# EasyEDA Pro project kod-01-akdk.eprj, board kod-01-left-pcb
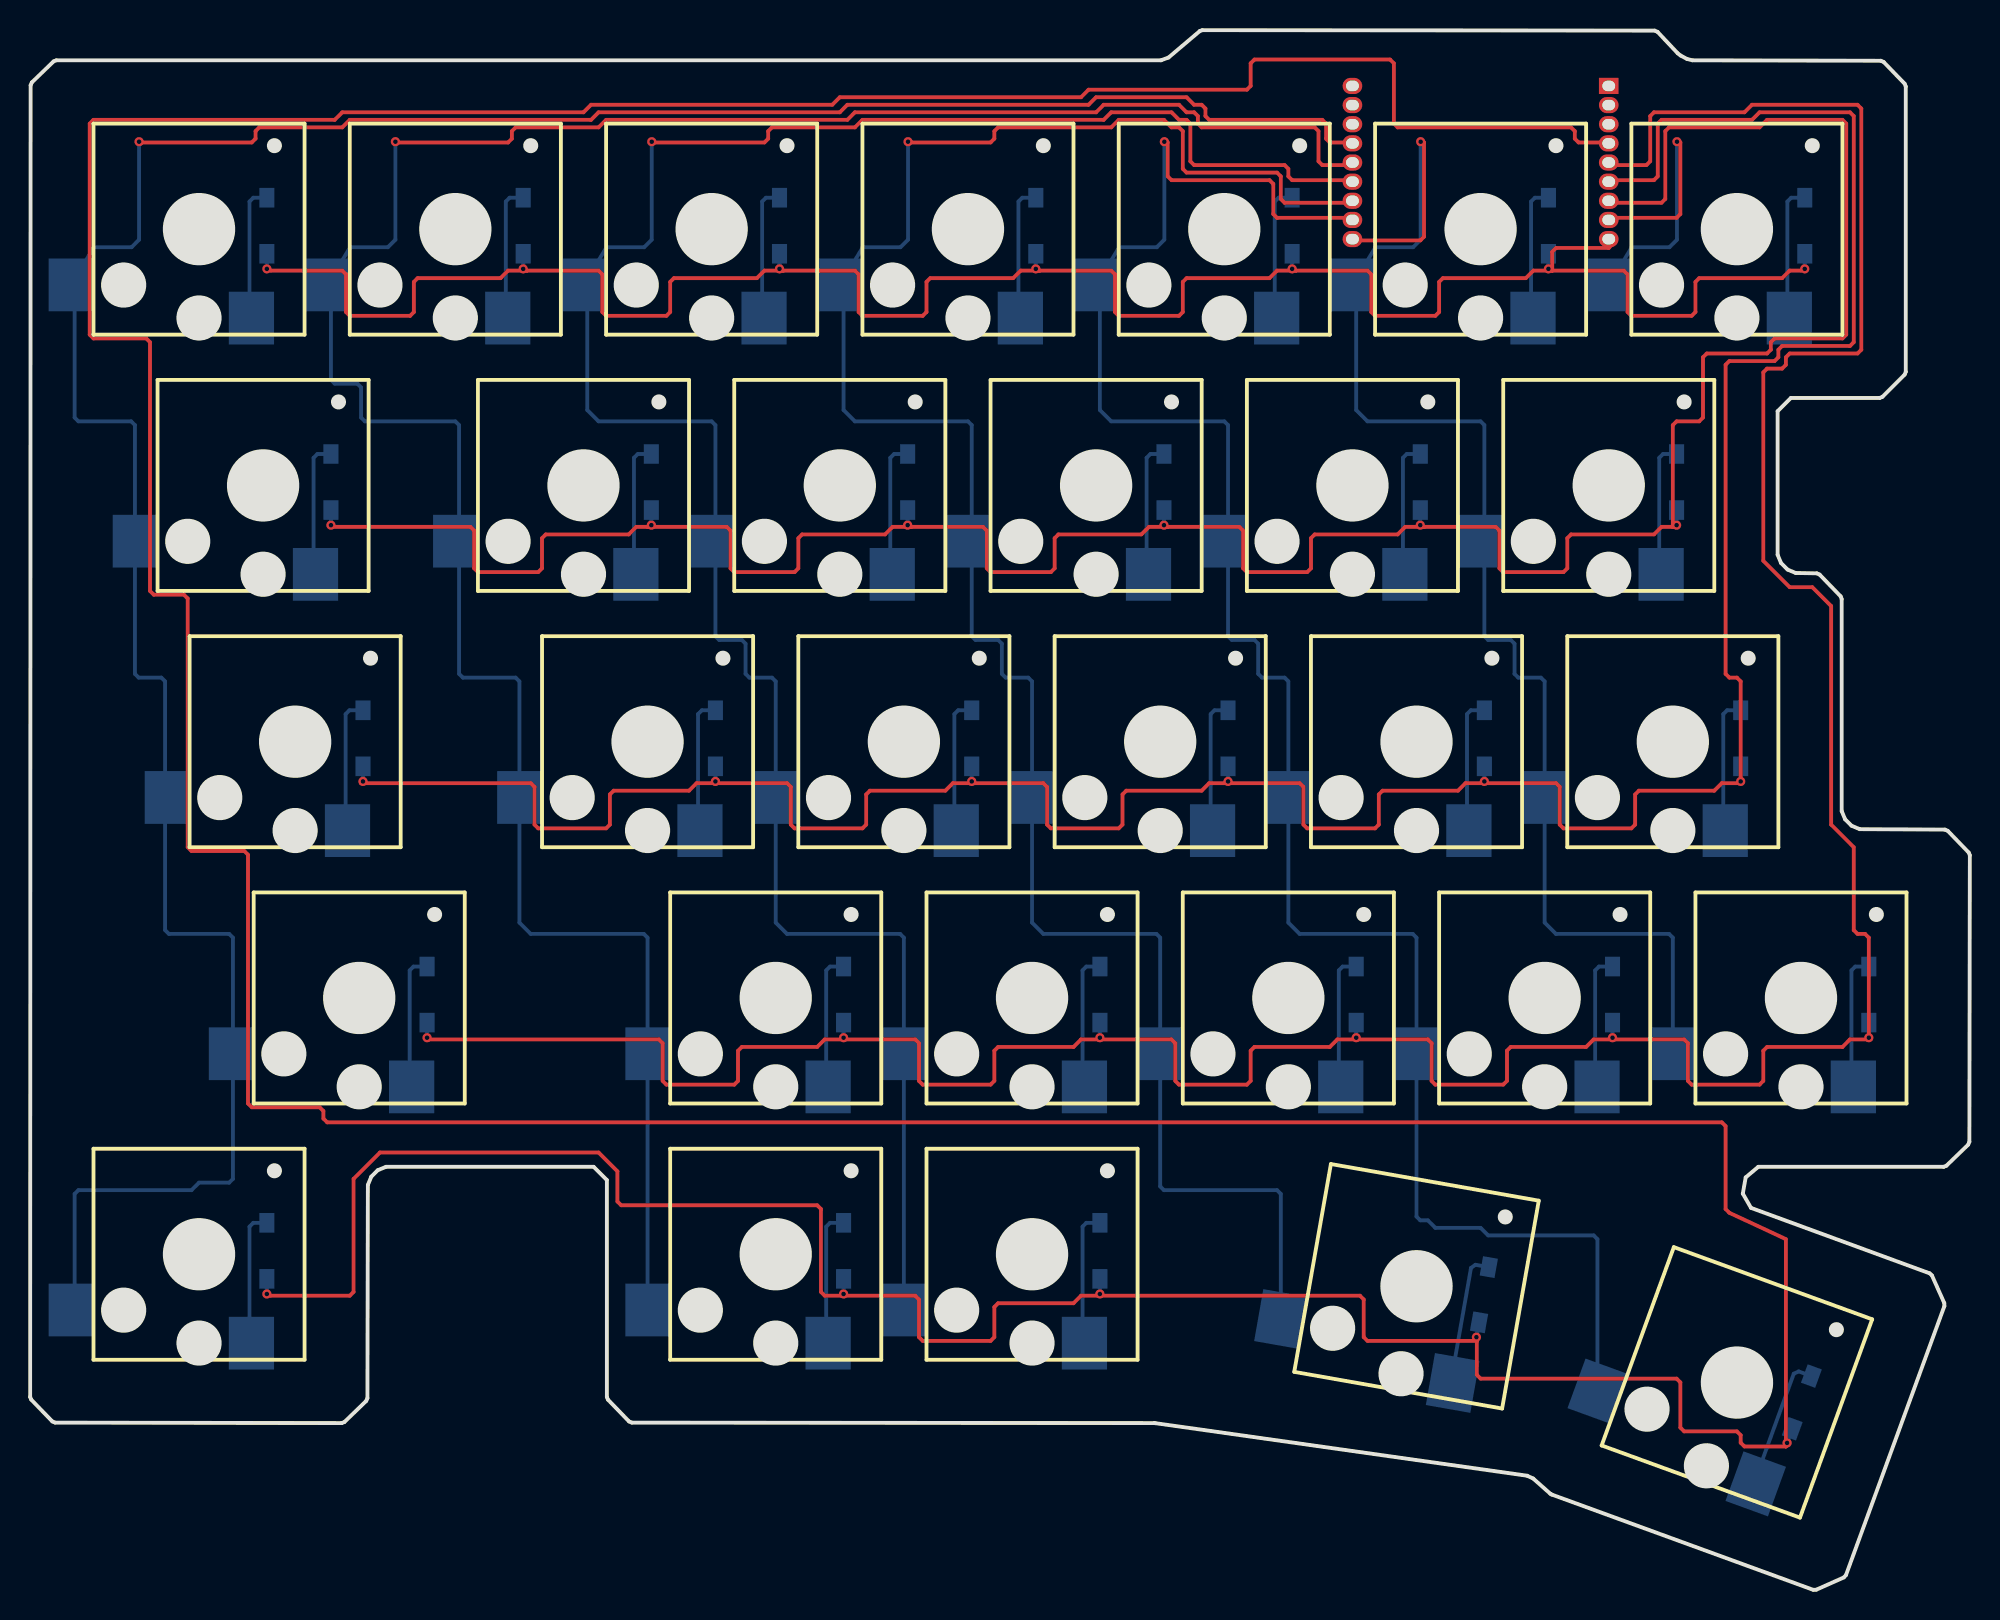
[diagram p0: board, top side]
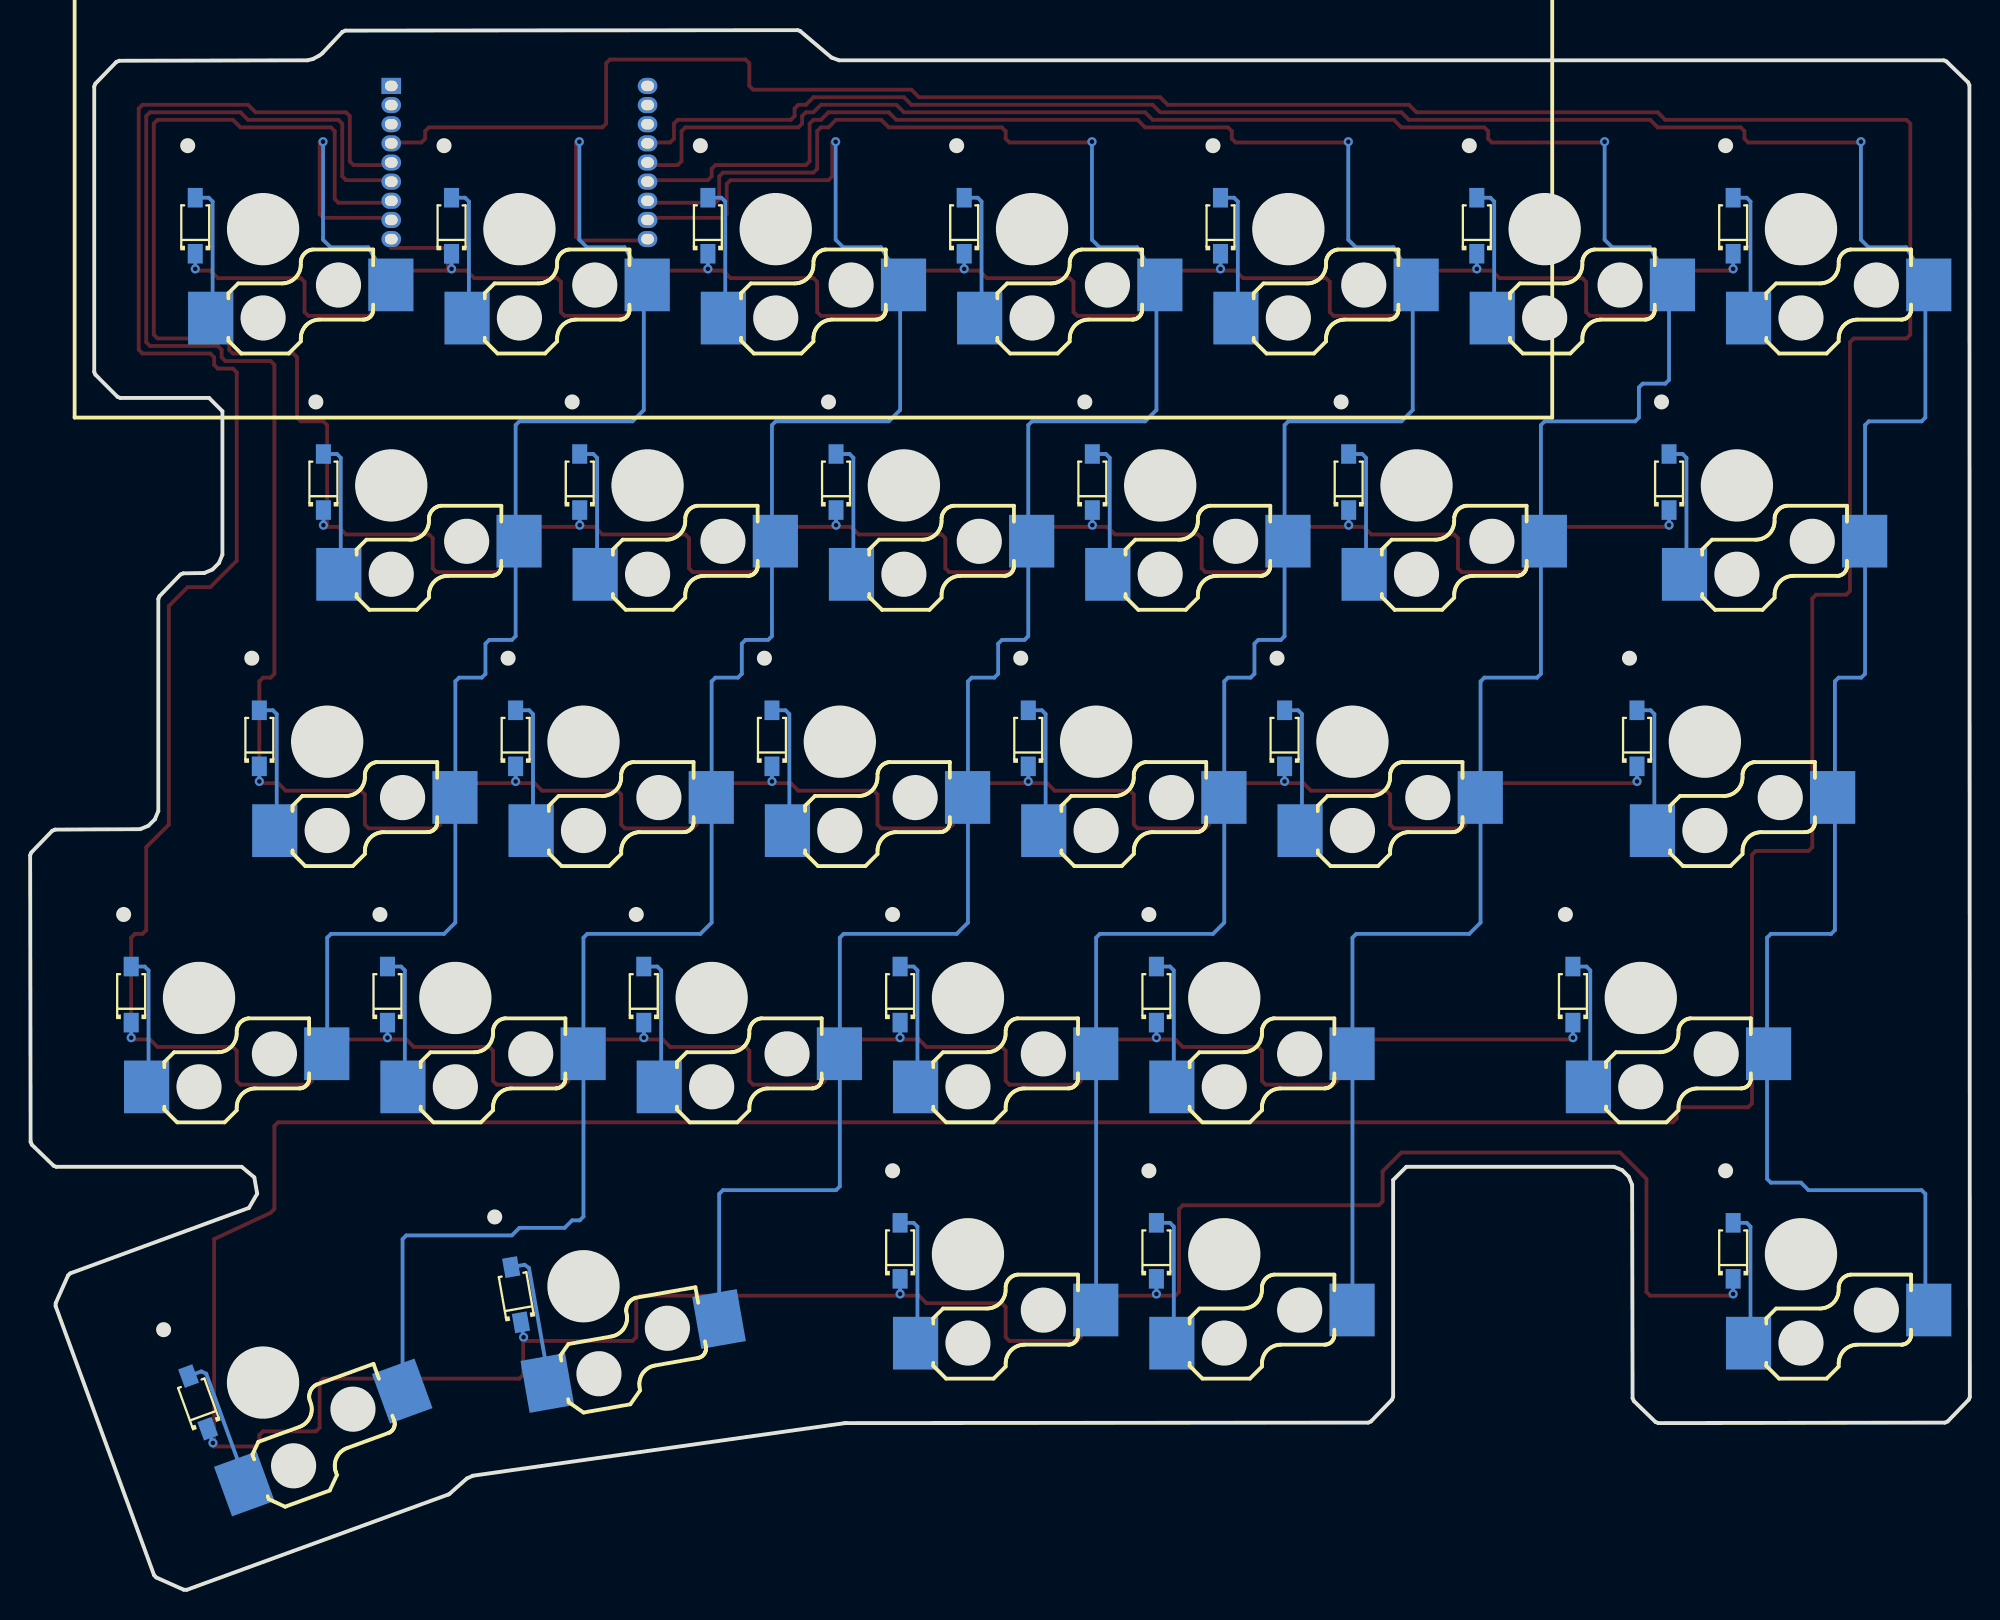
[diagram p1: board, bottom side, seen from below]

Outline 128.65 x 103.46 mm; copper layers: Top Layer, Bottom Layer. Coordinates in mm from the lower left corner of the outline.
Outline path: 0,12.8 0.03,99.81 0.11,99.99 1.55,101.39 1.73,101.46 75,101.46 75.5,101.65 77.58,103.4 77.74,103.46 107.75,103.43 107.94,103.35 109.27,101.93 109.47,101.78 109.89,101.55 110.25,101.46 122.74,101.43 122.93,101.35 124.33,99.91 124.4,99.73 124.4,80.79 124.32,80.61 122.85,79.14 122.67,79.06 116.78,79.06 115.9,78.18 115.9,68.66 116.13,68.11 116.56,67.68 117.1,67.45 118.5,67.43 118.68,67.35 120.08,65.91 120.15,65.73 120.15,51.66 120.38,51.11 120.8,50.69 121.35,50.46 127,50.43 127.18,50.35 128.58,48.91 128.65,48.73 128.62,29.72 128.54,29.53 127.1,28.14 126.92,28.06 114.62,28.06 113.78,27.36 113.59,26.28 114.14,25.34 125.99,20.99 126.14,20.86 126.96,19.02 126.96,18.83 120.43,0.97 120.29,0.83 118.46,0.01 118.26,0 100.91,6.32 100.83,6.37 99.69,7.39 99.29,7.57 74.64,11.05 74.54,11.06 39.91,11.09 39.72,11.17 38.32,12.62 38.25,12.8 38.25,27.18 37.37,28.06 23.6,28.06 23.05,27.83 22.63,27.41 22.4,26.86 22.37,12.72 22.29,12.53 20.85,11.14 20.67,11.06 1.66,11.09 1.47,11.17 0.07,12.62 0,12.8

## Design rules (mm)
spacing Default (default): track to track 0.152, other pairs 0 to 0.152
track width Default (default): min 0.254, default 0.254, max 25.4
via Default (default): diameter min 0.61, default 0.61, max 100.025; hole min 0.305, default 0.305, max 59.995

## Placement (name value [footprint] x y rotation side)
D1  -  [1N4148W]  15.7 90.46 90 bottom
D2  -  [1N4148W]  32.7 90.46 90 bottom
D3  -  [1N4148W]  49.7 90.46 90 bottom
D4  -  [1N4148W]  66.7 90.46 90 bottom
D5  -  [1N4148W]  83.7 90.46 90 bottom
D6  -  [1N4148W]  100.7 90.46 90 bottom
D7  -  [1N4148W]  117.7 90.46 90 bottom
D8  -  [1N4148W]  19.95 73.46 90 bottom
D9  -  [1N4148W]  41.2 73.46 90 bottom
D10  -  [1N4148W]  58.2 73.46 90 bottom
D11  -  [1N4148W]  75.2 73.46 90 bottom
D12  -  [1N4148W]  92.2 73.46 90 bottom
D13  -  [1N4148W]  109.2 73.46 90 bottom
D14  -  [1N4148W]  22.08 56.46 90 bottom
D15  -  [1N4148W]  45.45 56.46 90 bottom
D16  -  [1N4148W]  62.45 56.46 90 bottom
D17  -  [1N4148W]  79.45 56.46 90 bottom
D18  -  [1N4148W]  96.45 56.46 90 bottom
D19  -  [1N4148W]  113.45 56.46 90 bottom
D20  -  [1N4148W]  26.33 39.46 90 bottom
D21  -  [1N4148W]  53.95 39.46 90 bottom
D22  -  [1N4148W]  70.95 39.46 90 bottom
D23  -  [1N4148W]  87.95 39.46 90 bottom
D24  -  [1N4148W]  104.95 39.46 90 bottom
D25  -  [1N4148W]  121.95 39.46 90 bottom
D26  -  [1N4148W]  15.7 22.46 90 bottom
D27  -  [1N4148W]  53.95 22.46 90 bottom
D28  -  [1N4148W]  70.95 22.46 90 bottom
D29  -  [1N4148W#3]  96.42 19.55 100 bottom
D30  -  [1N4148W#2]  117.5 12.41 110 bottom
SW1  -  [CPG135001S30]  8.7 85.46 180 bottom
SW2  -  [CPG135001S30]  25.7 85.46 180 bottom
SW3  -  [CPG135001S30]  42.7 85.46 180 bottom
SW4  -  [CPG135001S30]  59.7 85.46 180 bottom
SW5  -  [CPG135001S30]  76.7 85.46 180 bottom
SW6  -  [CPG135001S30]  93.7 85.46 180 bottom
SW7  -  [CPG135001S30]  110.7 85.46 180 bottom
SW8  -  [CPG135001S30]  12.95 68.46 180 bottom
SW9  -  [CPG135001S30]  34.2 68.46 180 bottom
SW10  -  [CPG135001S30]  51.2 68.46 180 bottom
SW11  -  [CPG135001S30]  68.2 68.46 180 bottom
SW12  -  [CPG135001S30]  85.2 68.46 180 bottom
SW13  -  [CPG135001S30]  102.2 68.46 180 bottom
SW14  -  [CPG135001S30]  15.08 51.46 180 bottom
SW15  -  [CPG135001S30]  38.45 51.46 180 bottom
SW16  -  [CPG135001S30]  55.45 51.46 180 bottom
SW17  -  [CPG135001S30]  72.45 51.46 180 bottom
SW18  -  [CPG135001S30]  89.45 51.46 180 bottom
SW19  -  [CPG135001S30]  106.45 51.46 180 bottom
SW20  -  [CPG135001S30]  19.33 34.46 180 bottom
SW21  -  [CPG135001S30]  46.95 34.46 180 bottom
SW22  -  [CPG135001S30]  63.95 34.46 180 bottom
SW23  -  [CPG135001S30]  80.95 34.46 180 bottom
SW24  -  [CPG135001S30]  97.95 34.46 180 bottom
SW25  -  [CPG135001S30]  114.95 34.46 180 bottom
SW26  -  [CPG135001S30]  8.7 17.46 180 bottom
SW27  -  [CPG135001S30]  46.95 17.46 180 bottom
SW28  -  [CPG135001S30]  63.95 17.46 180 bottom
SW29  -  [CPG135001S30#3]  88.65 15.84 190 bottom
SW30  -  [CPG135001S30#2]  109.21 10.11 200 bottom
U1  -  [MS88SF2_1-1-3-SIDE2]  104.7 99.76 0 bottom

## Footprints (pads in the part's own frame, mm; a bottom-side part is the same pattern mirrored in y, then rotated)
1N4148W
  rect 1.3x1 smd: 1(-1.835,0) 2(1.884,0)
1N4148W#2
  rect 1.3x1 smd rot 140: 1(-1.405,-1.179) 2(1.443,1.211)
1N4148W#3
  rect 1.3x1 smd rot 160: 1(-1.724,-0.627) 2(1.77,0.644)
CPG135001S30
  rect 3x3.5 smd: 1(5.975,1.1) 2(-5.975,-1.1)
CPG135001S30#2
  rect 3x3.5 smd rot 140: 1(3.87,4.684) 2(-3.87,-4.684)
CPG135001S30#3
  rect 3x3.5 smd rot 160: 1(5.239,3.078) 2(-5.239,-3.078)
MS88SF2_1-1-3-SIDE2
  rect 1.3x1.07 hole 0.85x0.7: 1(0,0)
  oval 1.3x1.07 hole 0.85x0.7: 2(0,1.27) 3(0,2.54) 4(0,3.81) 5(0,5.08) 6(0,6.35) 7(0,7.62) 8(0,8.89) 9(0,10.16) 10(-17,10.16) 11(-17,8.89) 12(-17,7.62) 13(-17,6.35) 14(-17,5.08) 15(-17,3.81) 16(-17,2.54) 17(-17,1.27) 18(-17,0)

## Nets
COL0: SW1.1 SW8.1 SW14.1 SW20.1 SW26.1 U1.15
COL1: SW2.1 SW9.1 SW15.1 SW21.1 SW27.1 U1.14
COL2: SW3.1 SW10.1 SW16.1 SW22.1 SW28.1 U1.13
COL3: SW4.1 SW11.1 SW17.1 SW23.1 SW29.1 U1.12
COL4: SW5.1 SW12.1 SW18.1 SW24.1 SW30.1 U1.11
COL5: SW6.1 SW13.1 SW19.1 SW25.1 U1.10
COL6: SW7.1 U1.8
ROW0: D1.1 D2.1 D3.1 D4.1 D5.1 D6.1 D7.1 U1.9
ROW1: D8.1 D9.1 D10.1 D11.1 D12.1 D13.1 U1.7
ROW2: D14.1 D15.1 D16.1 D17.1 D18.1 D19.1 U1.6
ROW3: D20.1 D21.1 D22.1 D23.1 D24.1 D25.1 U1.5
ROW4: D26.1 D27.1 D28.1 D29.1 D30.1 U1.4
SW1_2: D1.2 SW1.2
SW2_2: D2.2 SW2.2
SW3_2: D3.2 SW3.2
SW4_2: D4.2 SW4.2
SW5_2: D5.2 SW5.2
SW6_2: D6.2 SW6.2
SW7_2: D7.2 SW7.2
SW8_2: D8.2 SW8.2
SW9_2: D9.2 SW9.2
SW10_2: D10.2 SW10.2
SW11_2: D11.2 SW11.2
SW12_2: D12.2 SW12.2
SW13_2: D13.2 SW13.2
SW14_2: D14.2 SW14.2
SW15_2: D15.2 SW15.2
SW16_2: D16.2 SW16.2
SW17_2: D17.2 SW17.2
SW18_2: D18.2 SW18.2
SW19_2: D19.2 SW19.2
SW20_2: D20.2 SW20.2
SW21_2: D21.2 SW21.2
SW22_2: D22.2 SW22.2
SW23_2: D23.2 SW23.2
SW24_2: D24.2 SW24.2
SW25_2: D25.2 SW25.2
SW26_2: D26.2 SW26.2
SW27_2: D27.2 SW27.2
SW28_2: D28.2 SW28.2
SW29_2: D29.2 SW29.2
SW30_2: D30.2 SW30.2

Pads without a net: U1 1 2 3 16 17 18

## Via types
v1: diameter 0.61, hole 0.305, Top Layer to Bottom Layer, 37 vias

## Routing (per net, layer and track width the routed paths; a pad name or vN(x,y) marks a point on that pad's centre or on a via; arc(x,y) is an arc through that point)
COL0: length 185.9
  Top Layer w0.254: U1.15 87.95,96.01 86.2,96.01 85.95,96.26 85.95,97.26 85.7,97.51 78.2,97.51 77.95,97.76 77.95,98.26 77.7,98.51 77.2,98.51 76.7,99.01 70.7,99.01 70.2,98.51 54.2,98.51 53.7,98.01 37.7,98.01 37.2,97.51 21.2,97.51 20.7,97.01 15.2,97.01 14.95,96.76 14.95,96.26 14.7,96.01 7.45,96.01 v1(7.22,96.06)
  Bottom Layer w0.254: 2.72,18.56 2.95,18.51 2.95,26.26 3.2,26.51 10.7,26.51 11.2,27.01 13.2,27.01 13.45,27.26 13.45,35.51 ; v1(7.22,96.06) 7.22,89.56 6.72,89.06 4.22,89.06 2.72,86.56 2.95,86.51 2.95,77.76 3.2,77.51 6.7,77.51 6.95,77.26 6.95,69.51 ; 8.95,52.51 8.95,60.26 8.7,60.51 7.2,60.51 6.95,60.76 6.95,69.51 ; 8.95,52.51 SW14.1 8.95,52.51 ; 8.95,52.51 8.95,43.76 9.2,43.51 13.2,43.51 13.45,43.26 13.45,35.51 ; 6.95,69.51 SW8.1 6.95,69.51 ; 13.45,35.51 SW20.1 13.45,35.51
COL1: length 169.6
  Top Layer w0.254: v1(24.22,96.06) 24.45,96.01 31.7,96.01 31.95,96.26 31.95,96.76 32.2,97.01 37.7,97.01 38.2,97.51 54.2,97.51 54.7,98.01 70.7,98.01 71.2,98.51 76.2,98.51 76.7,98.01 77.2,98.01 77.45,97.76 77.45,97.26 77.7,97.01 85.2,97.01 85.45,96.76 85.45,94.76 85.7,94.51 87.95,94.51 U1.14
  Bottom Layer w0.254: 28.45,69.51 28.22,69.56 28.45,69.51 ; 28.45,69.51 28.45,77.26 28.2,77.51 22.2,77.51 21.95,77.76 21.95,79.76 21.7,80.01 20.2,80.01 19.95,80.26 19.95,86.51 19.72,86.56 21.22,89.06 23.72,89.06 24.22,89.56 v1(24.22,96.06) ; 28.45,69.51 28.45,60.76 28.7,60.51 32.2,60.51 32.45,60.26 32.45,52.51 ; 32.45,52.51 32.45,44.26 33.2,43.51 40.7,43.51 40.95,43.26 40.95,35.51 ; 32.45,52.51 SW15.1 32.45,52.51 ; 40.95,35.51 40.95,18.51 SW27.1 ; 40.95,35.51 SW21.1 40.95,35.51
COL2: length 152.6
  Top Layer w0.254: v1(41.22,96.06) 41.45,96.01 48.7,96.01 48.95,96.26 48.95,96.76 49.2,97.01 54.7,97.01 55.2,97.51 71.2,97.51 71.7,98.01 75.7,98.01 76.2,97.51 76.7,97.51 76.95,97.26 76.95,94.76 77.2,94.51 83.2,94.51 83.45,94.26 83.45,93.76 83.7,93.51 87.95,93.51 U1.13
  Bottom Layer w0.254: SW28.1 57.95,18.51 57.95,35.51 ; 45.45,69.51 SW10.1 45.45,69.51 ; 45.45,69.51 45.45,63.26 45.7,63.01 47.2,63.01 47.45,62.76 47.45,60.76 47.7,60.51 49.2,60.51 49.45,60.26 49.45,52.51 ; 45.45,69.51 45.45,77.26 45.2,77.51 37.7,77.51 36.95,78.26 36.95,86.51 SW3.1 38.22,89.06 40.72,89.06 41.22,89.56 v1(41.22,96.06) ; 49.45,52.51 SW16.1 49.45,52.51 ; 49.45,52.51 49.45,44.26 50.2,43.51 57.7,43.51 57.95,43.26 57.95,35.51 ; 57.95,35.51 SW22.1 57.95,35.51
COL3: length 144.6
  Top Layer w0.254: U1.12 87.95,92.01 83.2,92.01 82.95,92.26 82.95,93.76 82.7,94.01 76.7,94.01 76.45,94.26 76.45,96.76 76.2,97.01 75.7,97.01 75.2,97.51 72.2,97.51 71.7,97.01 64.2,97.01 63.95,96.76 63.95,96.26 63.7,96.01 58.45,96.01 v1(58.22,96.06)
  Bottom Layer w0.254: 82.96,17.97 82.95,18.01 82.95,26.26 82.7,26.51 75.2,26.51 74.95,26.76 74.95,35.51 ; 74.95,35.51 74.95,43.26 74.7,43.51 67.2,43.51 66.45,44.26 66.45,52.51 ; 74.95,35.51 SW23.1 74.95,35.51 ; 66.45,52.51 66.45,60.26 66.2,60.51 64.7,60.51 64.45,60.76 64.45,62.76 64.2,63.01 62.7,63.01 62.45,63.26 62.45,69.51 ; 66.45,52.51 SW17.1 66.45,52.51 ; 62.45,69.51 62.45,77.26 62.2,77.51 54.7,77.51 53.95,78.26 53.95,86.51 SW4.1 55.22,89.06 57.72,89.06 58.22,89.56 v1(58.22,96.06) ; 62.45,69.51 SW11.1 62.45,69.51
COL4: length 135.2
  Top Layer w0.254: U1.11 87.95,91.01 82.7,91.01 82.45,91.26 82.45,93.26 82.2,93.51 75.7,93.51 75.45,93.76 75.45,96.01 v1(75.22,96.06)
  Bottom Layer w0.254: 91.95,35.51 SW24.1 91.95,35.51 ; 91.95,35.51 91.95,43.26 91.7,43.51 84.2,43.51 83.45,44.26 83.45,52.51 ; 91.95,35.51 91.95,24.76 92.2,24.51 92.7,24.51 93.2,24.01 96.2,24.01 96.7,23.51 103.7,23.51 103.95,23.26 103.95,13.01 SW30.1 ; v1(75.22,96.06) 75.22,89.56 74.72,89.06 72.22,89.06 SW5.1 70.95,86.51 70.95,78.26 71.7,77.51 79.2,77.51 79.45,77.26 79.45,69.51 ; 79.45,69.51 SW12.1 79.45,69.51 ; 79.45,69.51 79.45,63.26 79.7,63.01 81.2,63.01 81.45,62.76 81.45,60.76 81.7,60.51 83.2,60.51 83.45,60.26 83.45,52.51 ; 83.45,52.51 SW18.1 83.45,52.51
COL5: length 95.1
  Top Layer w0.254: U1.10 87.95,89.51 92.2,89.51 92.45,89.76 92.45,96.01 v1(92.22,96.06)
  Bottom Layer w0.254: 100.45,52.51 SW19.1 100.45,52.51 ; 100.45,52.51 100.45,60.26 100.2,60.51 98.7,60.51 98.45,60.76 98.45,62.76 98.2,63.01 96.7,63.01 96.45,63.26 96.45,69.51 ; 100.45,52.51 100.45,44.26 101.2,43.51 108.7,43.51 108.95,43.26 108.95,35.51 SW25.1 ; 96.45,69.51 SW13.1 96.45,69.51 ; 96.45,69.51 96.45,77.26 96.2,77.51 88.7,77.51 87.95,78.26 87.95,86.51 SW6.1 89.22,89.06 91.72,89.06 92.22,89.56 v1(92.22,96.06)
COL6: length 22.5
  Top Layer w0.254: U1.8 104.95,91.01 109.2,91.01 109.45,91.26 109.45,96.01 v1(109.22,96.06)
  Bottom Layer w0.254: v1(109.22,96.06) 109.22,89.56 108.72,89.06 106.22,89.06 SW7.1
ROW0: length 148.8
  Top Layer w0.254: 66.95,87.51 71.7,87.51 71.95,87.26 71.95,84.76 72.2,84.51 76.2,84.51 76.45,84.76 76.45,86.76 76.7,87.01 82.2,87.01 82.7,87.51 83.95,87.51 ; 66.95,87.51 65.7,87.51 65.2,87.01 59.7,87.01 59.45,86.76 59.45,84.76 59.2,84.51 55.2,84.51 54.95,84.76 54.95,87.26 54.7,87.51 49.95,87.51 ; 66.95,87.51 v1(66.7,87.63) 66.95,87.51 ; 83.95,87.51 v1(83.7,87.63) 83.95,87.51 ; 83.95,87.51 88.7,87.51 88.95,87.26 88.95,84.76 89.2,84.51 93.2,84.51 93.45,84.76 93.45,86.76 93.7,87.01 99.2,87.01 99.7,87.51 100.95,87.51 ; 49.95,87.51 v1(49.7,87.63) 49.95,87.51 ; 49.95,87.51 48.7,87.51 48.2,87.01 42.7,87.01 42.45,86.76 42.45,84.76 42.2,84.51 38.2,84.51 37.95,84.76 37.95,87.26 37.7,87.51 32.95,87.51 ; 32.95,87.51 31.7,87.51 31.2,87.01 25.7,87.01 25.45,86.76 25.45,84.76 25.2,84.51 21.2,84.51 20.95,84.76 20.95,87.26 20.7,87.51 15.95,87.51 v1(15.7,87.63) ; 32.95,87.51 v1(32.7,87.63) 32.95,87.51 ; v1(117.7,87.63) 117.45,87.51 116.7,87.51 116.2,87.01 110.7,87.01 110.45,86.76 110.45,84.76 110.2,84.51 106.2,84.51 105.95,84.76 105.95,87.26 105.7,87.51 100.95,87.51 ; 100.95,87.51 100.95,88.76 101.2,89.01 104.7,89.01 104.95,89.26 104.95,89.51 U1.9 ; 100.95,87.51 v1(100.7,87.63) ; 100.95,87.51 v1(100.7,87.63) ; 100.95,87.51 v1(100.7,87.63)
  Bottom Layer w0.254: D4.1 v1(66.7,87.63) ; D2.1 v1(32.7,87.63) ; D6.1 v1(100.7,87.63) ; D1.1 v1(15.7,87.63) ; D3.1 v1(49.7,87.63) ; D5.1 v1(83.7,87.63) ; D7.1 v1(117.7,87.63)
ROW1: length 181.6
  Top Layer w0.254: 108.95,70.51 108.2,70.51 107.7,70.01 102.2,70.01 101.95,69.76 101.95,67.76 101.7,67.51 97.7,67.51 97.45,67.76 97.45,70.26 97.2,70.51 92.45,70.51 ; 108.95,70.51 108.95,77.26 109.2,77.51 110.7,77.51 110.95,77.76 110.95,81.76 111.2,82.01 115.2,82.01 115.45,82.26 115.45,82.76 115.7,83.01 120.2,83.01 120.45,83.26 120.45,97.26 120.2,97.51 115.2,97.51 114.7,97.01 108.7,97.01 108.45,96.76 108.45,92.26 108.2,92.01 104.95,92.01 U1.7 ; 108.95,70.51 v1(109.2,70.63) 108.95,70.51 ; 58.45,70.51 v1(58.2,70.63) 58.45,70.51 ; 58.45,70.51 63.2,70.51 63.45,70.26 63.45,67.76 63.7,67.51 67.7,67.51 67.95,67.76 67.95,69.76 68.2,70.01 73.7,70.01 74.2,70.51 75.45,70.51 ; 58.45,70.51 57.2,70.51 56.7,70.01 51.2,70.01 50.95,69.76 50.95,67.76 50.7,67.51 46.7,67.51 46.45,67.76 46.45,70.26 46.2,70.51 40.95,70.51 ; 75.45,70.51 80.2,70.51 80.45,70.26 80.45,67.76 80.7,67.51 84.7,67.51 84.95,67.76 84.95,69.76 85.2,70.01 90.7,70.01 91.2,70.51 92.45,70.51 ; 75.45,70.51 v1(75.2,70.63) 75.45,70.51 ; 40.95,70.51 v1(41.2,70.63) 40.95,70.51 ; 40.95,70.51 40.2,70.51 39.7,70.01 34.2,70.01 33.95,69.76 33.95,67.76 33.7,67.51 29.7,67.51 29.45,67.76 29.45,70.26 29.2,70.51 19.95,70.51 v1(19.95,70.63) ; 92.45,70.51 v1(92.2,70.63) 92.45,70.51
  Bottom Layer w0.254: D9.1 v1(41.2,70.63) ; D12.1 v1(92.2,70.63) ; D8.1 v1(19.95,70.63) ; D10.1 v1(58.2,70.63) ; D11.1 v1(75.2,70.63) ; D13.1 v1(109.2,70.63)
ROW2: length 197.6
  Top Layer w0.254: 96.45,53.51 v1(96.45,53.63) 96.45,53.51 ; 96.45,53.51 101.2,53.51 101.45,53.26 101.45,50.76 101.7,50.51 106.2,50.51 106.45,50.76 106.45,52.76 106.7,53.01 111.7,53.01 112.2,53.51 113.45,53.51 ; 96.45,53.51 95.2,53.51 94.7,53.01 89.7,53.01 89.45,52.76 89.45,50.76 89.2,50.51 84.7,50.51 84.45,50.76 84.45,53.26 84.2,53.51 79.45,53.51 ; 79.45,53.51 v1(79.45,53.63) 79.45,53.51 ; 79.45,53.51 78.2,53.51 77.7,53.01 72.7,53.01 72.45,52.76 72.45,50.76 72.2,50.51 67.7,50.51 67.45,50.76 67.45,53.26 67.2,53.51 62.45,53.51 ; 45.45,53.51 50.2,53.51 50.45,53.26 50.45,50.76 50.7,50.51 55.2,50.51 55.45,50.76 55.45,52.76 55.7,53.01 60.7,53.01 61.2,53.51 62.45,53.51 ; 45.45,53.51 44.2,53.51 43.7,53.01 38.7,53.01 38.45,52.76 38.45,50.76 38.2,50.51 33.7,50.51 33.45,50.76 33.45,53.26 33.2,53.51 21.95,53.51 v1(22.08,53.63) ; 45.45,53.51 v1(45.45,53.63) 45.45,53.51 ; 62.45,53.51 v1(62.45,53.63) 62.45,53.51 ; 113.45,53.51 v1(113.45,53.63) 113.45,53.51 ; 113.45,53.51 113.45,60.26 113.2,60.51 112.7,60.51 112.45,60.76 112.45,81.26 112.7,81.51 115.7,81.51 115.95,81.76 115.95,82.26 116.2,82.51 120.7,82.51 120.95,82.76 120.95,97.76 120.7,98.01 114.7,98.01 114.2,97.51 108.2,97.51 107.95,97.26 107.95,93.76 107.7,93.51 104.95,93.51 U1.6
  Bottom Layer w0.254: D15.1 v1(45.45,53.63) ; D18.1 v1(96.45,53.63) ; D19.1 v1(113.45,53.63) ; D16.1 v1(62.45,53.63) ; D14.1 v1(22.08,53.63) ; D17.1 v1(79.45,53.63)
ROW3: length 220.5
  Top Layer w0.254: 70.95,36.51 v1(70.95,36.63) 70.95,36.51 ; 70.95,36.51 69.7,36.51 69.2,36.01 64.2,36.01 63.95,35.76 63.95,33.76 63.7,33.51 59.2,33.51 58.95,33.76 58.95,36.26 58.7,36.51 53.95,36.51 ; 70.95,36.51 75.7,36.51 75.95,36.26 75.95,33.76 76.2,33.51 80.7,33.51 80.95,33.76 80.95,35.76 81.2,36.01 86.2,36.01 86.7,36.51 87.95,36.51 ; 121.95,36.51 v1(121.95,36.63) 121.95,36.51 ; 121.95,36.51 121.95,43.26 121.7,43.51 121.2,43.51 120.95,43.76 120.95,49.26 119.45,50.76 119.45,65.26 118.2,66.51 116.7,66.51 114.95,68.26 114.95,80.76 115.2,81.01 116.2,81.01 116.45,81.26 116.45,81.76 116.7,82.01 121.2,82.01 121.45,82.26 121.45,98.26 121.2,98.51 114.2,98.51 113.7,98.01 107.7,98.01 107.45,97.76 107.45,94.76 107.2,94.51 104.95,94.51 U1.5 ; 121.95,36.51 120.7,36.51 120.2,36.01 115.2,36.01 114.95,35.76 114.95,33.76 114.7,33.51 110.2,33.51 109.95,33.76 109.95,36.26 109.7,36.51 104.95,36.51 ; 87.95,36.51 v1(87.95,36.63) 87.95,36.51 ; 87.95,36.51 92.7,36.51 92.95,36.26 92.95,33.76 93.2,33.51 97.7,33.51 97.95,33.76 97.95,35.76 98.2,36.01 103.2,36.01 103.7,36.51 104.95,36.51 ; 53.95,36.51 v1(53.95,36.63) 53.95,36.51 ; 53.95,36.51 52.7,36.51 52.2,36.01 47.2,36.01 46.95,35.76 46.95,33.76 46.7,33.51 42.2,33.51 41.95,33.76 41.95,36.26 41.7,36.51 26.45,36.51 v1(26.33,36.63) ; 104.95,36.51 v1(104.95,36.63) 104.95,36.51
  Bottom Layer w0.254: D25.1 v1(121.95,36.63) ; D22.1 v1(70.95,36.63) ; D24.1 v1(104.95,36.63) ; D23.1 v1(87.95,36.63) ; D20.1 v1(26.33,36.63) ; D21.1 v1(53.95,36.63)
ROW4: length 444.1
  Top Layer w0.254: v1(15.7,19.63) 15.95,19.51 21.2,19.51 21.45,19.76 21.45,27.26 23.2,29.01 37.7,29.01 38.95,27.76 38.95,25.76 39.2,25.51 52.2,25.51 52.45,25.26 52.45,19.76 52.7,19.51 53.95,19.51 ; 95.95,16.51 95.95,14.26 96.2,14.01 109.2,14.01 109.45,13.76 109.45,10.76 109.7,10.51 113.2,10.51 113.45,10.26 113.45,9.76 113.7,9.51 116.45,9.51 ; 95.95,16.51 v1(95.92,16.76) 95.95,16.51 ; 95.95,16.51 88.7,16.51 88.45,16.76 88.45,19.26 88.2,19.51 70.95,19.51 ; 116.45,9.51 116.45,23.26 112.7,25.01 112.45,25.26 112.45,30.76 112.2,31.01 19.7,31.01 19.45,31.26 19.45,31.76 19.2,32.01 14.7,32.01 14.45,32.26 14.45,48.76 14.2,49.01 10.7,49.01 10.45,49.26 10.45,65.76 10.2,66.01 8.2,66.01 7.95,66.26 7.95,82.76 7.7,83.01 4.2,83.01 3.95,83.26 3.95,97.26 4.2,97.51 20.2,97.51 20.7,98.01 36.7,98.01 37.2,98.51 53.2,98.51 53.7,99.01 69.7,99.01 70.2,99.51 80.7,99.51 80.95,99.76 80.95,101.26 81.2,101.51 90.2,101.51 90.45,101.26 90.45,97.26 90.7,97.01 102.2,97.01 102.45,96.76 102.45,96.26 102.7,96.01 104.95,96.01 U1.4 ; 116.45,9.51 v1(116.53,9.75) 116.45,9.51 ; 53.95,19.51 v1(53.95,19.63) 53.95,19.51 ; 53.95,19.51 58.7,19.51 58.95,19.26 58.95,16.76 59.2,16.51 63.7,16.51 63.95,16.76 63.95,18.76 64.2,19.01 69.2,19.01 69.7,19.51 70.95,19.51 ; 70.95,19.51 v1(70.95,19.63) 70.95,19.51
  Bottom Layer w0.254: D30.1 v1(116.53,9.75) ; D29.1 v1(95.92,16.76) ; D28.1 v1(70.95,19.63) ; D27.1 v1(53.95,19.63) ; D26.1 v1(15.7,19.63)
SW1_2: length 9.1
  Bottom Layer w0.254: SW1.2 14.55,84.36 14.55,92.09 14.8,92.35 D1.2
SW2_2: length 9.1
  Bottom Layer w0.254: D2.2 31.8,92.35 31.55,92.09 31.55,84.36 SW2.2
SW3_2: length 9.1
  Bottom Layer w0.254: 48.68,84.36 48.55,84.36 48.55,92.09 48.8,92.35 D3.2
SW4_2: length 9.1
  Bottom Layer w0.254: 65.68,84.36 65.55,84.36 65.55,92.09 65.8,92.35 D4.2
SW5_2: length 9.1
  Bottom Layer w0.254: 82.68,84.36 82.55,84.36 82.55,92.09 82.8,92.35 D5.2
SW6_2: length 9.1
  Bottom Layer w0.254: D6.2 99.8,92.35 99.55,92.09 99.55,84.36 99.68,84.36
SW7_2: length 9.1
  Bottom Layer w0.254: 116.68,84.36 116.55,84.36 116.55,92.09 116.8,92.35 D7.2
SW8_2: length 9.1
  Bottom Layer w0.254: D8.2 19.05,75.35 18.8,75.09 18.8,67.36 SW8.2
SW9_2: length 9.1
  Bottom Layer w0.254: SW9.2 40.05,67.36 40.05,75.09 40.3,75.35 D9.2
SW10_2: length 9.1
  Bottom Layer w0.254: 57.18,67.36 57.05,67.36 57.05,75.09 57.3,75.35 D10.2
SW11_2: length 9.1
  Bottom Layer w0.254: 74.18,67.36 74.05,67.36 74.05,75.09 74.3,75.35 D11.2
SW12_2: length 9.1
  Bottom Layer w0.254: D12.2 91.3,75.35 91.05,75.09 91.05,67.36 91.18,67.36
SW13_2: length 9.1
  Bottom Layer w0.254: 108.18,67.36 108.05,67.36 108.05,75.09 108.3,75.35 D13.2
SW14_2: length 9.1
  Bottom Layer w0.254: SW14.2 20.92,50.36 20.92,58.09 21.18,58.35 D14.2
SW15_2: length 9.1
  Bottom Layer w0.254: SW15.2 44.3,50.36 44.3,58.09 44.55,58.35 D15.2
SW16_2: length 9.1
  Bottom Layer w0.254: D16.2 61.55,58.35 61.3,58.09 61.3,50.36 SW16.2
SW17_2: length 9.1
  Bottom Layer w0.254: SW17.2 78.3,50.36 78.3,58.09 78.55,58.35 D17.2
SW18_2: length 9.1
  Bottom Layer w0.254: SW18.2 95.3,50.36 95.3,58.09 95.55,58.35 D18.2
SW19_2: length 9.1
  Bottom Layer w0.254: SW19.2 112.3,50.36 112.3,58.09 112.55,58.35 D19.2
SW20_2: length 9.1
  Bottom Layer w0.254: D20.2 25.43,41.35 25.17,41.09 25.17,33.36 SW20.2
SW21_2: length 9.1
  Bottom Layer w0.254: D21.2 53.05,41.35 52.8,41.09 52.8,33.36 SW21.2
SW22_2: length 9.1
  Bottom Layer w0.254: SW22.2 69.8,33.36 69.8,41.09 70.05,41.35 D22.2
SW23_2: length 9.1
  Bottom Layer w0.254: D23.2 87.05,41.35 86.8,41.09 86.8,33.36 SW23.2
SW24_2: length 9.1
  Bottom Layer w0.254: SW24.2 103.8,33.36 103.8,41.09 104.05,41.35 D24.2
SW25_2: length 9.1
  Bottom Layer w0.254: SW25.2 120.8,33.36 120.8,41.09 121.05,41.35 D25.2
SW26_2: length 9.1
  Bottom Layer w0.254: D26.2 14.8,24.35 14.55,24.09 14.55,16.36 SW26.2
SW27_2: length 9.1
  Bottom Layer w0.254: SW27.2 52.8,16.36 52.8,24.09 53.05,24.35 D27.2
SW28_2: length 9.1
  Bottom Layer w0.254: D28.2 70.05,24.35 69.8,24.09 69.8,16.36 SW28.2
SW29_2: length 9.1
  Bottom Layer w0.254: 94.35,13.72 94.22,13.75 95.56,21.36 95.86,21.56 D29.2
SW30_2: length 9.1
  Bottom Layer w0.254: 118.14,14.18 117.3,14.49 116.97,14.34 114.33,7.07 114.45,7.03
